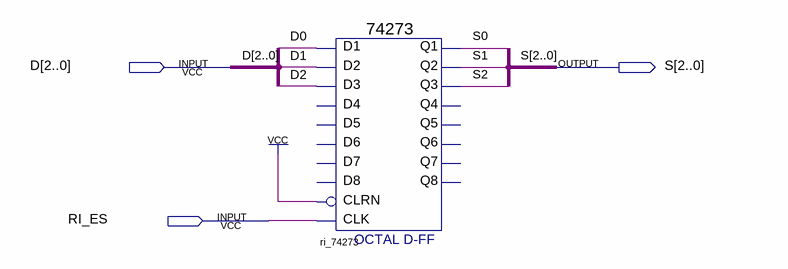
[diagram p0: schematic sheet]
// Quartus schematic RI_RegistradorInstrucoes.bdf as structural Verilog: 1 symbols, 3 pins
module RI_RegistradorInstrucoes (
  input  [2:0] D,
  input  RI_ES,
  output [2:0] S
);

  \74273  ri_74273 (
    .D2(D[1]), .D3(D[2]), .D1(D[0]), .CLK(RI_ES), .CLRN(1'b1), .Q1(S[0]), .Q2(S[1]), .Q3(S[2]));  // open: D4, D7, D6, D5, D8, Q4, Q6, Q5, Q7, Q8
endmodule
